# EAGLE design detector_de_sal_ou_acucar (EAGLE 9.6.2)
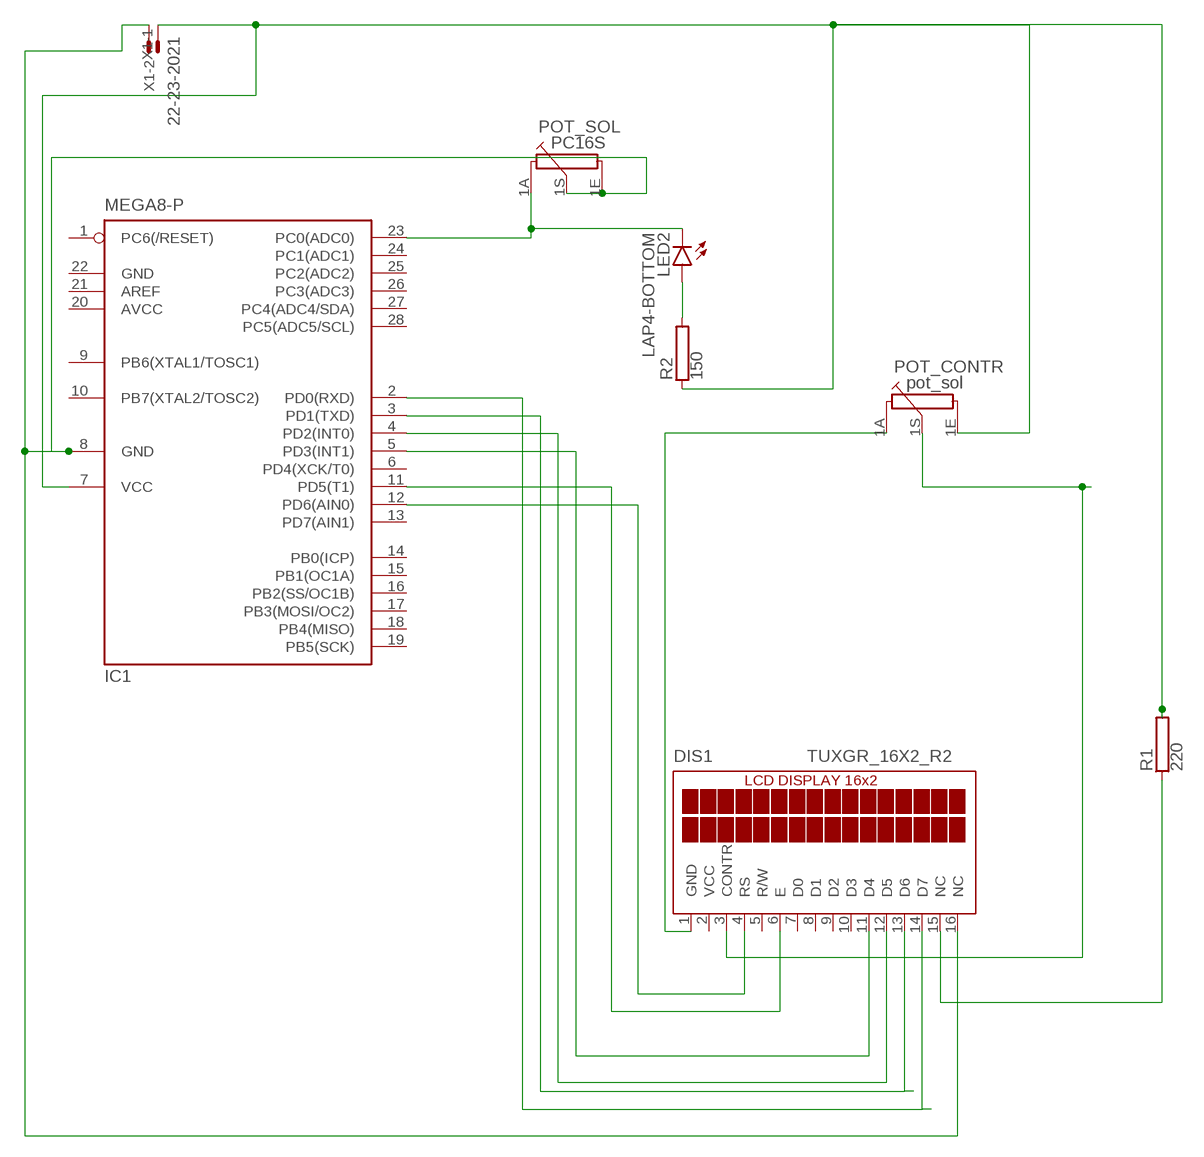
[diagram p0: schematic, sheet 1]

## Parts
DIS1  TUXGR_16X2_R2  [TUXGR_16X2_R2]
IC1  MEGA8-P  [DIL28-3]
LED2  LAP4-BOTTOM  [P47F-BOTTOM]
POT_CONTR  pot_sol  PC16S  [PC16S]
POT_SOL  PC16S  [PC16S]
R1  220  RAC01  [AC01]
R2  150  RAC01  [AC01]
X1  22-23-2021  [22-23-2021]

## Nets
N$1: DIS1.4(RS) IC1.12(PD6(AIN0))
N$2: DIS1.6(E) IC1.11(PD5(T1))
N$3: DIS1.11(D4) IC1.5(PD3(INT1))
N$4: DIS1.12(D5) IC1.4(PD2(INT0))
N$5: DIS1.13(D6) IC1.3(PD1(TXD))
N$6: DIS1.14(D7) IC1.2(PD0(RXD))
N$7: DIS1.15(NC) R1.1
N$8: IC1.7(VCC) POT_CONTR.1E R1.2 R2.1 X1.1
N$9: DIS1.3(CONTR) POT_CONTR.1S
N$10: DIS1.1(GND) POT_CONTR.1A
N$11: IC1.23(PC0(ADC0)) LED2.C POT_SOL.1A
N$12: DIS1.16(NC) IC1.8(GND) POT_SOL.1E POT_SOL.1S X1.2
N$13: LED2.A R2.2
Unconnected: DIS1.5(R/W) DIS1.7(D0) DIS1.8(D1) DIS1.9(D2) DIS1.10(D3) IC1.1(PC6(/RESET)) IC1.6(PD4(XCK/T0)) IC1.9(PB6(XTAL1/TOSC1)) IC1.10(PB7(XTAL2/TOSC2)) IC1.13(PD7(AIN1)) IC1.14(PB0(ICP)) IC1.15(PB1(OC1A)) IC1.16(PB2(SS/OC1B)) IC1.17(PB3(MOSI/OC2)) IC1.18(PB4(MISO)) IC1.19(PB5(SCK)) IC1.21(AREF) IC1.24(PC1(ADC1)) IC1.25(PC2(ADC2)) IC1.26(PC3(ADC3)) IC1.27(PC4(ADC4/SDA)) IC1.28(PC5(ADC5/SCL))

## Power pins joined to a net without a drawn wire
AVCC: IC1.20(AVCC)
GND: IC1.22(GND)
VCC: DIS1.2(VCC)

## Library data of the parts
DIS1 = display-lcd:TUXGR_16X2_R2: Tuxgraphics LCD display 16x2 characters reflective, without background light Source: tuxgr_12x2_r2.pdf; OC_FARNELL: unknown; OC_NEWARK: unknown
IC1 = atmel:MEGA8-P: MICROCONTROLLER 8 Kbytes FLASH, 1 kbytes SRAM, 512 bytes EEPROM, USART, 4-channel 10 bit ADC, 2-channel 8 bit ADC Pin compatible with Atmega48, ATMega88, ATMega168 Source: avr.lbr; OC_FARNELL: unknown; OC_NEWARK: unknown
LED2 = led:*P4: PointLED® Enhanced Thinfilm LED TOP & BOTTOM mount LS P47F, LR P47F, LA P47F, LY P47F, LT P4SG, LB P4SG, LW P4SG Source: http://catalog.osram-os.com .. LA_LR_LS_LY_P47F_Pb_free.pdf
POT_CONTR POT_SOL = piher:PC16S: POTENTIOMETER single carbon potentiometer, 16 mm, S3ROH; OC_FARNELL: 4452940; OC_NEWARK: unknown
R1 R2 = resistor-power:R: Power Resitor; OC_FARNELL: unknown; OC_NEWARK: unknown
X1 = con-molex:22-23-2021: .100" (2.54mm) Center Header - 2 Pin; MF: MOLEX; MPN: 22-23-2021; OC_FARNELL: 1462926; OC_NEWARK: 25C3832

## Board
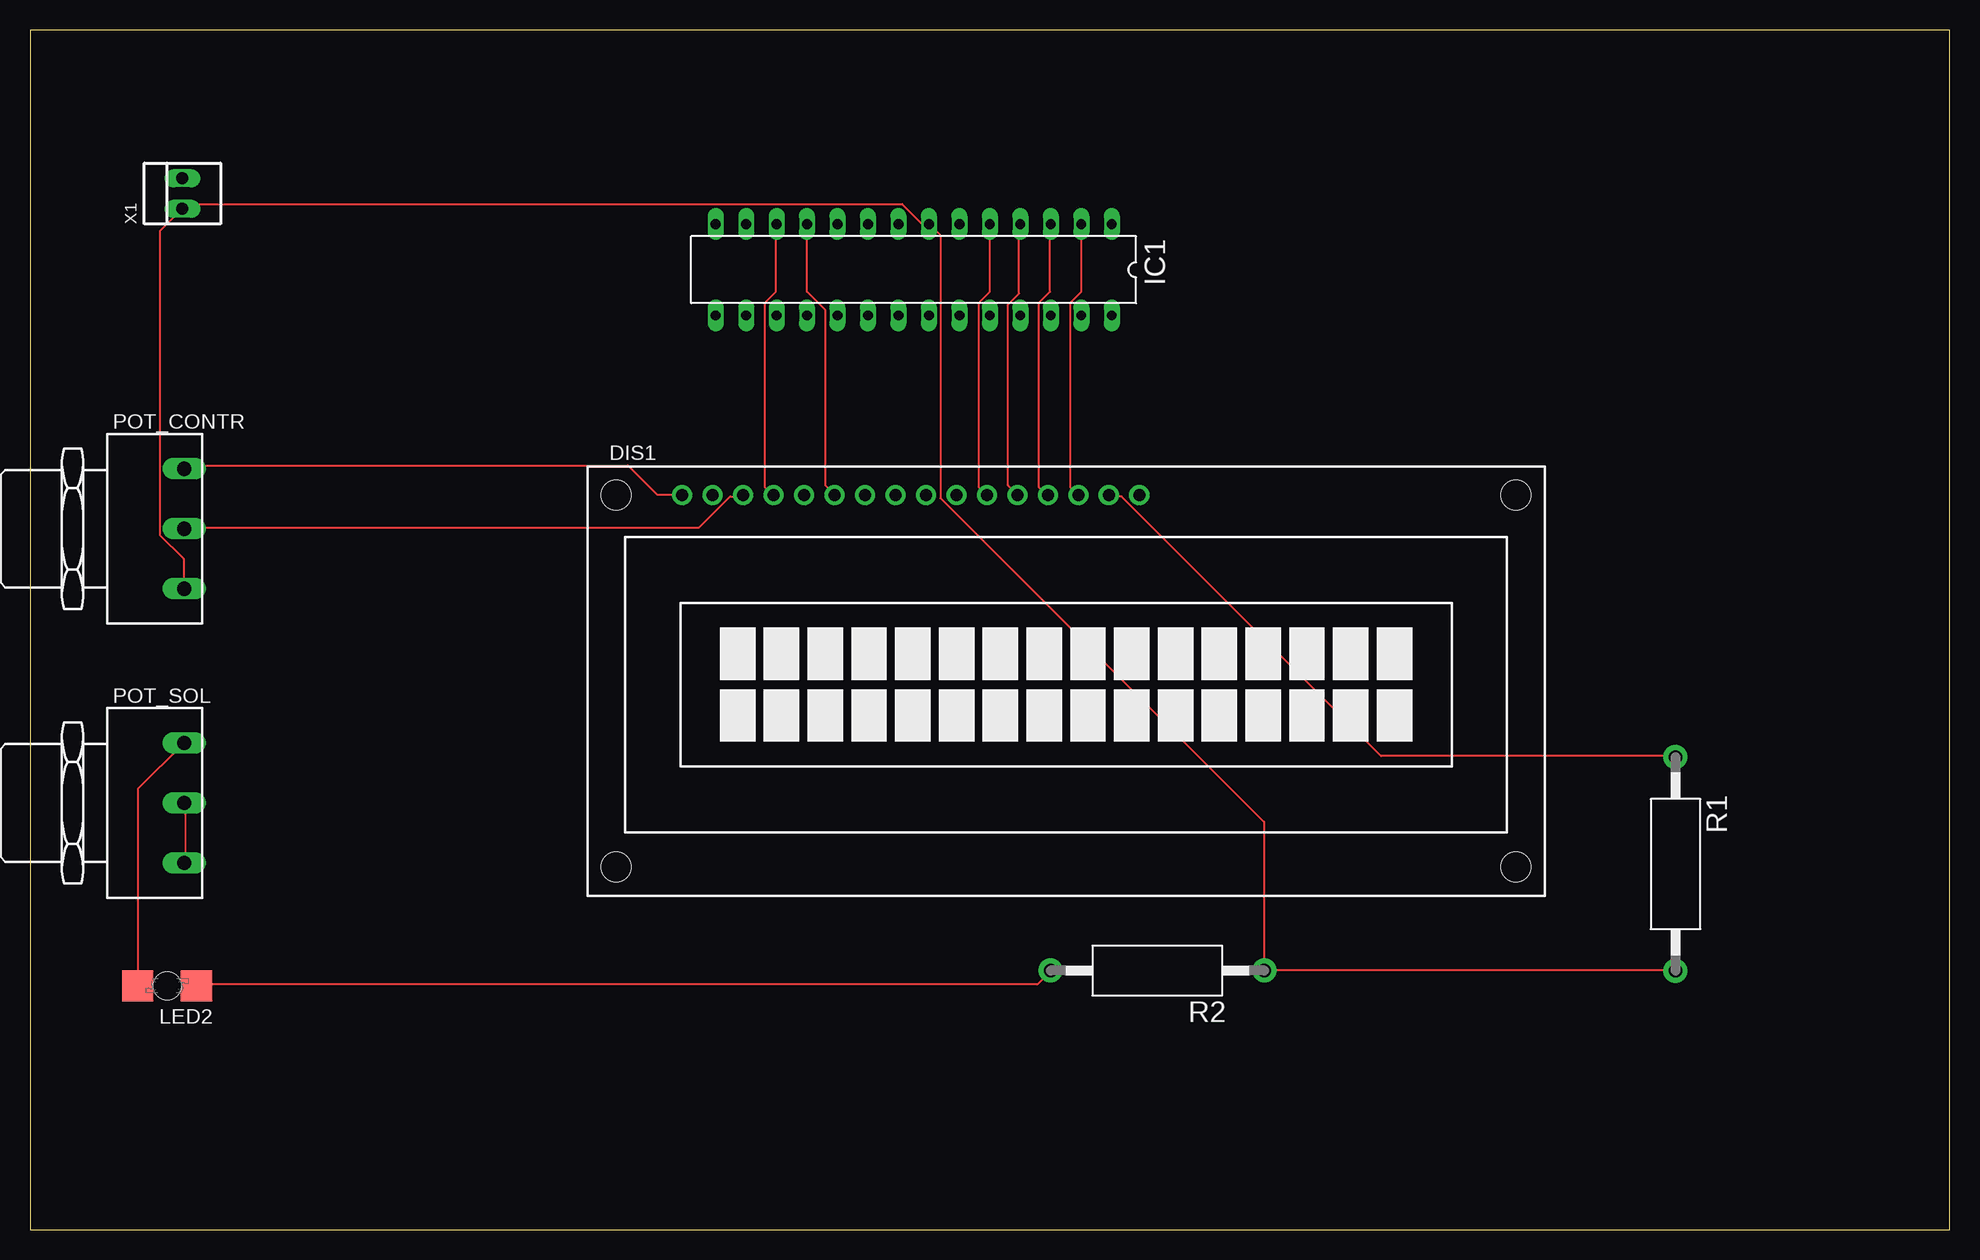
[diagram p1: board, top side]
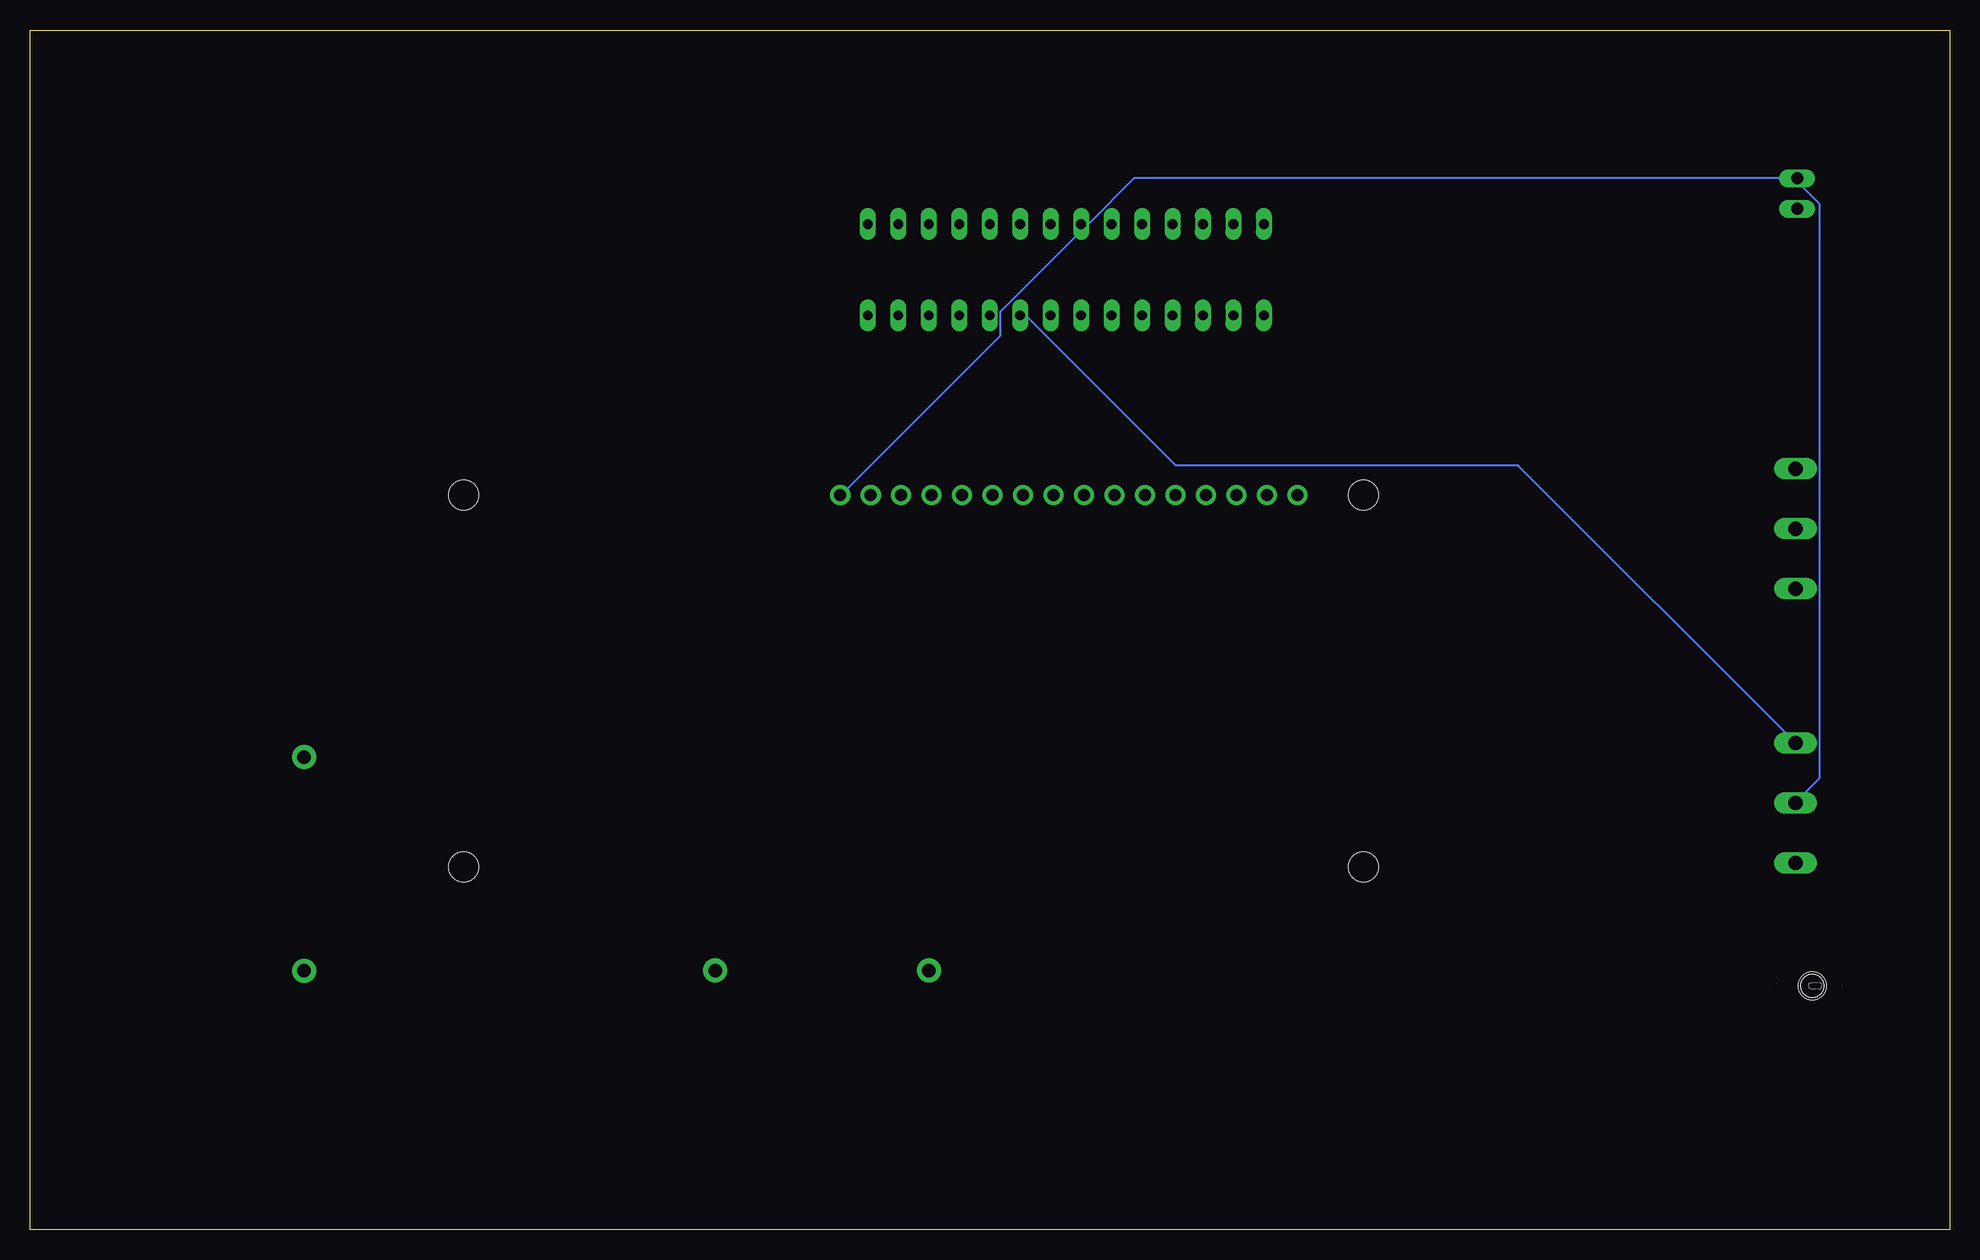
[diagram p2: board, bottom side, seen from below]

Size 160 x 100 mm. Coordinates in mm from the lower left corner, seen from the top.
Outline: 0,0 160,0 160,100 0,100 0,0
Copper layers (1*16): Top 0.035mm / dielectric 1.5mm / Bottom 0.035mm
Design rules "default": minimum track width 6mil, minimum drill 0.35mm, track to track 6mil, track to pad 6mil, pad to pad 6mil, via to via 6mil, smd to smd 6mil, copper to edge 40mil, drill to drill 6mil, minimum pad ring 10mil, minimum via ring 8mil, stop-mask expansion 4mil, vias tented up to drill 0mil, thermal gap 10mil

### Footprints (pad centres in the part's own frame; a part is rotated, then mirrored left to right if it is on the bottom)
TUXGR_16X2_R2 = drill 1 pad 1.676: 1 -32,15.5; 2 -29.46,15.5; 3 -26.92,15.5; 4 -24.38,15.5; 5 -21.84,15.5; 6 -19.3,15.5; 7 -16.76,15.5; 8 -14.22,15.5; 9 -11.68,15.5; 10 -9.14,15.5; 11 -6.6,15.5; 12 -4.06,15.5; 13 -1.52,15.5; 14 1.02,15.5; 15 3.56,15.5; 16 6.1,15.5 | hole 2.5: -37.5,-15.5; 37.5,-15.5; -37.5,15.5; 37.5,15.5
DIL28-3 = drill 0.813 long: 1 -16.51,-3.81; 2 -13.97,-3.81; 3 -11.43,-3.81; 4 -8.89,-3.81; 5 -6.35,-3.81; 6 -3.81,-3.81; 7 -1.27,-3.81; 8 1.27,-3.81; 9 3.81,-3.81; 10 6.35,-3.81; 11 8.89,-3.81; 12 11.43,-3.81; 13 13.97,-3.81; 14 16.51,-3.81; 15 16.51,3.81; 16 13.97,3.81; 17 11.43,3.81; 18 8.89,3.81; 19 6.35,3.81; 20 3.81,3.81; 21 1.27,3.81; 22 -1.27,3.81; 23 -3.81,3.81; 24 -6.35,3.81; 25 -8.89,3.81; 26 -11.43,3.81; 27 -13.97,3.81; 28 -16.51,3.81
P47F-BOTTOM = smd 2.6 x 2.6: A -2.45,0; C 2.45,0 | hole 2.3: 0,0
PC16S = drill 1.2 long: 1A -5,6.5; 1E 5,6.5; 1S 0,6.5
AC01 = drill 1.1 pad 2: 1 -8.9,0; 2 8.9,0
22-23-2021 = drill 1 long: 1 -1.27,0; 2 1.27,0

### Placement (x,y rotation side)
DIS1  86.36,45.72 0 top
IC1  73.66,80.01 180 top
LED2  11.43,20.32 180 top
POT_CONTR  6.35,58.42 270 top
POT_SOL  6.35,35.56 270 top
R1  137.16,30.48 270 top
R2  93.98,21.59 180 top
X1  12.7,86.36 90 top

### Tracks (layer width: path | path; a pad name or v marks a point on that pad's centre or on a via)
N$1
  Top 0.152: IC1.12 62.18,83.82 62.18,78.18 61.27,77.27 61.27,61.87 61.87,61.27 DIS1.4
N$2
  Top 0.152: IC1.11 64.77,78.18 66.29,76.66 66.29,62.03 67.06,61.27 DIS1.6
N$3
  Top 0.152: IC1.5 80.01,78.18 79.1,77.27 79.1,61.87 79.7,61.27 DIS1.11
N$4
  Top 0.152: IC1.4 82.45,83.82 82.45,78.03 81.53,77.11 81.53,62.03 82.3,61.27 DIS1.12
N$5
  Top 0.152: IC1.3 85.04,83.82 85.04,78.18 84.12,77.27 84.12,61.87 84.73,61.27 DIS1.13
N$6
  Top 0.152: IC1.2 87.63,78.18 86.72,77.27 86.72,61.87 87.33,61.27 DIS1.14
N$7
  Top 0.152: DIS1.15 90.07,61.11 90.98,61.11 112.62,39.47 137.16,39.47 R1.1
N$8
  Top 0.152: R1.2 137.16,21.64 103.02,21.64 R2.1 102.87,21.64 102.87,33.98 75.89,60.96 75.89,82.91 74.98,83.82 IC1.7 74.37,83.82 72.69,85.5 13.11,85.5 X1.1 10.82,83.21 10.82,57.91 12.8,55.93 12.8,53.49 POT_CONTR.1E
N$9
  Top 0.152: DIS1.3 59.44,61.11 58.37,61.11 55.78,58.52 12.95,58.52 POT_CONTR.1S
N$10
  Top 0.152: DIS1.1 54.25,61.27 52.27,61.27 49.84,63.7 13.11,63.7 12.95,63.55 POT_CONTR.1A
N$11
  Top 0.152: LED2.C 8.99,20.42 8.99,36.73 12.8,40.54 POT_SOL.1A
  Bottom 0.152: IC1.23 76.96,76.2 64.47,63.7 35.97,63.7 12.95,40.69 POT_SOL.1A
N$12
  Top 0.152: POT_SOL.1E 12.95,30.63 12.95,35.51 POT_SOL.1S
  Bottom 0.152: DIS1.16 92.35,61.27 79.1,74.52 79.1,76.5 72.39,83.21 IC1.8 71.78,83.82 67.97,87.63 X1.2 12.65,87.63 12.65,87.33 10.82,85.5 10.82,37.64 12.8,35.66 POT_SOL.1S
N$13
  Top 0.152: LED2.A 14.02,20.42 83.97,20.42 85.04,21.49 R2.2